# Altium schematic sheet Shuttler_AFE_SAS_CON.SchDoc: Shuttler AFE
size A4; Author: G.Kasprowicz; CompanyName: WUT ISE; DrawnBy: G.Kasprowicz; Organization: WUT ISE; Address1: PW ISE; Address2: Nowowiejska 15/19 00-665 Warsaw; Address3: gkasprow@gmail.com; DocumentNumber: 6; SheetNumber: 6; SheetTotal: 6; ModifiedBy: -; CheckedDate: -; Title2: SAS connectors; DivGrp: WUT ISE; Designer: G.Kasprowicz; ModifiedDate: -; ProjectName: Sensor Box
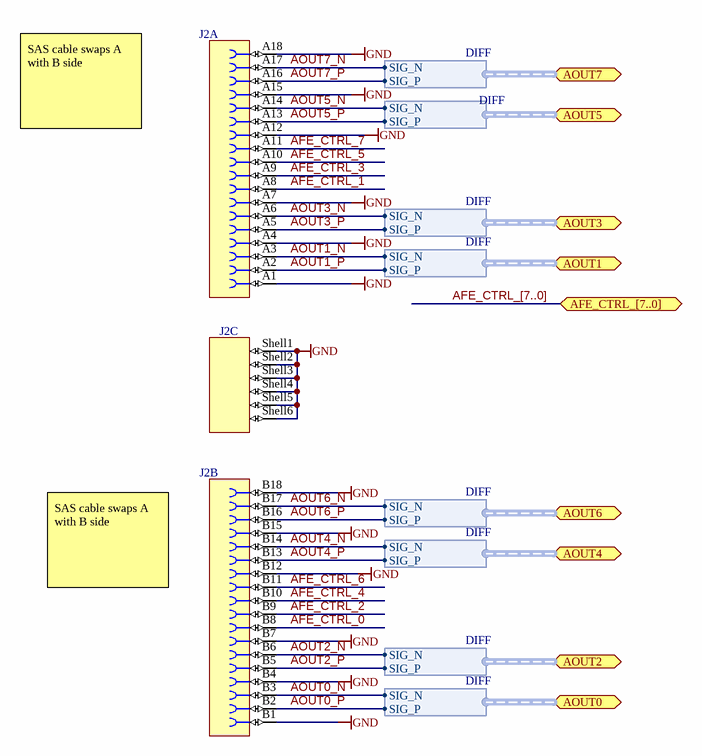
[diagram p0: Shuttler_AFE_SAS_CON.SchDoc]

## Parts
J2  iPass™  [MOLEX_75783-0107]  (value not drawn)  (parts A,B,C of 3)

## Ports
AFE_CTRL_[7..0] (bidir), AOUT0 (bidir, harness DIFF), AOUT1 (bidir, harness DIFF), AOUT2 (bidir, harness DIFF), AOUT3 (bidir, harness DIFF), AOUT4 (bidir, harness DIFF), AOUT5 (bidir, harness DIFF), AOUT6 (bidir, harness DIFF), AOUT7 (bidir, harness DIFF)

## Harnesses
DIFF: SIG_P, SIG_N

## Nets
GND: J2.A1 J2.A4 J2.A7 J2.A12 J2.A15 J2.A18 J2.B1 J2.B4 J2.B7 J2.B12 J2.B15 J2.B18 J2.Shell1 J2.Shell2 J2.Shell3 J2.Shell4 J2.Shell5 J2.Shell6
AFE_CTRL_0: J2.B8
AFE_CTRL_1: J2.A8
AFE_CTRL_2: J2.B9
AFE_CTRL_3: J2.A9
AFE_CTRL_4: J2.B10
AFE_CTRL_5: J2.A10
AFE_CTRL_6: J2.B11
AFE_CTRL_7: J2.A11
AOUT0_N: J2.B3 ; port AOUT0.SIG_N
AOUT0_P: J2.B2 ; port AOUT0.SIG_P
AOUT1_N: J2.A3 ; port AOUT1.SIG_N
AOUT1_P: J2.A2 ; port AOUT1.SIG_P
AOUT2_N: J2.B6 ; port AOUT2.SIG_N
AOUT2_P: J2.B5 ; port AOUT2.SIG_P
AOUT3_N: J2.A6 ; port AOUT3.SIG_N
AOUT3_P: J2.A5 ; port AOUT3.SIG_P
AOUT4_N: J2.B14 ; port AOUT4.SIG_N
AOUT4_P: J2.B13 ; port AOUT4.SIG_P
AOUT5_N: J2.A14 ; port AOUT5.SIG_N
AOUT5_P: J2.A13 ; port AOUT5.SIG_P
AOUT6_N: J2.B17 ; port AOUT6.SIG_N
AOUT6_P: J2.B16 ; port AOUT6.SIG_P
AOUT7_N: J2.A17 ; port AOUT7.SIG_N
AOUT7_P: J2.A16 ; port AOUT7.SIG_P

## Buses and harness runs
bus AFE_CTRL_[7..0] = port AFE_CTRL_[7..0]

## Notes on the sheet
- SAS cable swaps A with B side
- Project/Equipment
- Document
- Designer
- Drawn by
- Check.by
- Copyright WUT ISE 2020.
  This documentation describes Open Hardware and is licensed under the CERN OHL v.1.2. You may redistribute and modify this documentation under the terms of the CERN OHL v.1.2. (http://ohwr.org/CERNOHL). This documentation is distributed WITHOUT ANY EXPRESS OR IMPLIED WARRANTY, INCLUDING OF MERCHANTABILITY, SATISFACTORY QUALITY AND FITNESS FOR A PARTICULAR PURPOSE. Please see the CERN OHL v.1.2 for applicable conditions.
- Contact
- File
- Last Mod.
- Print Date
- Sheet
- Size
- A3
- of
- Rev

## Library data of the parts
J2 = MOLEX_75783-0107: 36 Circuit, Right Angle , Internal Assembly, iPass™ I/O Surface Mount Receptacle with Left Key Shell; Part Number: MOLEX 75783-0107 / 75783-0136; Manufacturer: MOLEX; Manufacturer Part Number: 75783-0107 / 75783-0136; PressFit: No; Component Kind: Standard; Component Type: Standard; Pin Count: 42; Family: iPass™; Mounted: Yes; Socket: No; SMD: Yes; Sense: No; Status: None; Part Description: 36 Circuit, Right Angle , Internal Assembly, iPass™ I/O Surface Mount Receptacle with Left Key Shell; ComponentHeight: 8.47mm; HelpURL: \\cern.ch\dfs\Applications\Altium\Datasheets\MOLEX_75783-0107.pdf; Author: CERN DEM JLC; CreateDate: 12.11.2014; LatestRevisionDate: 12.11.2014